# Altium project 2026MM.PrjPcb (part 2 of 10)
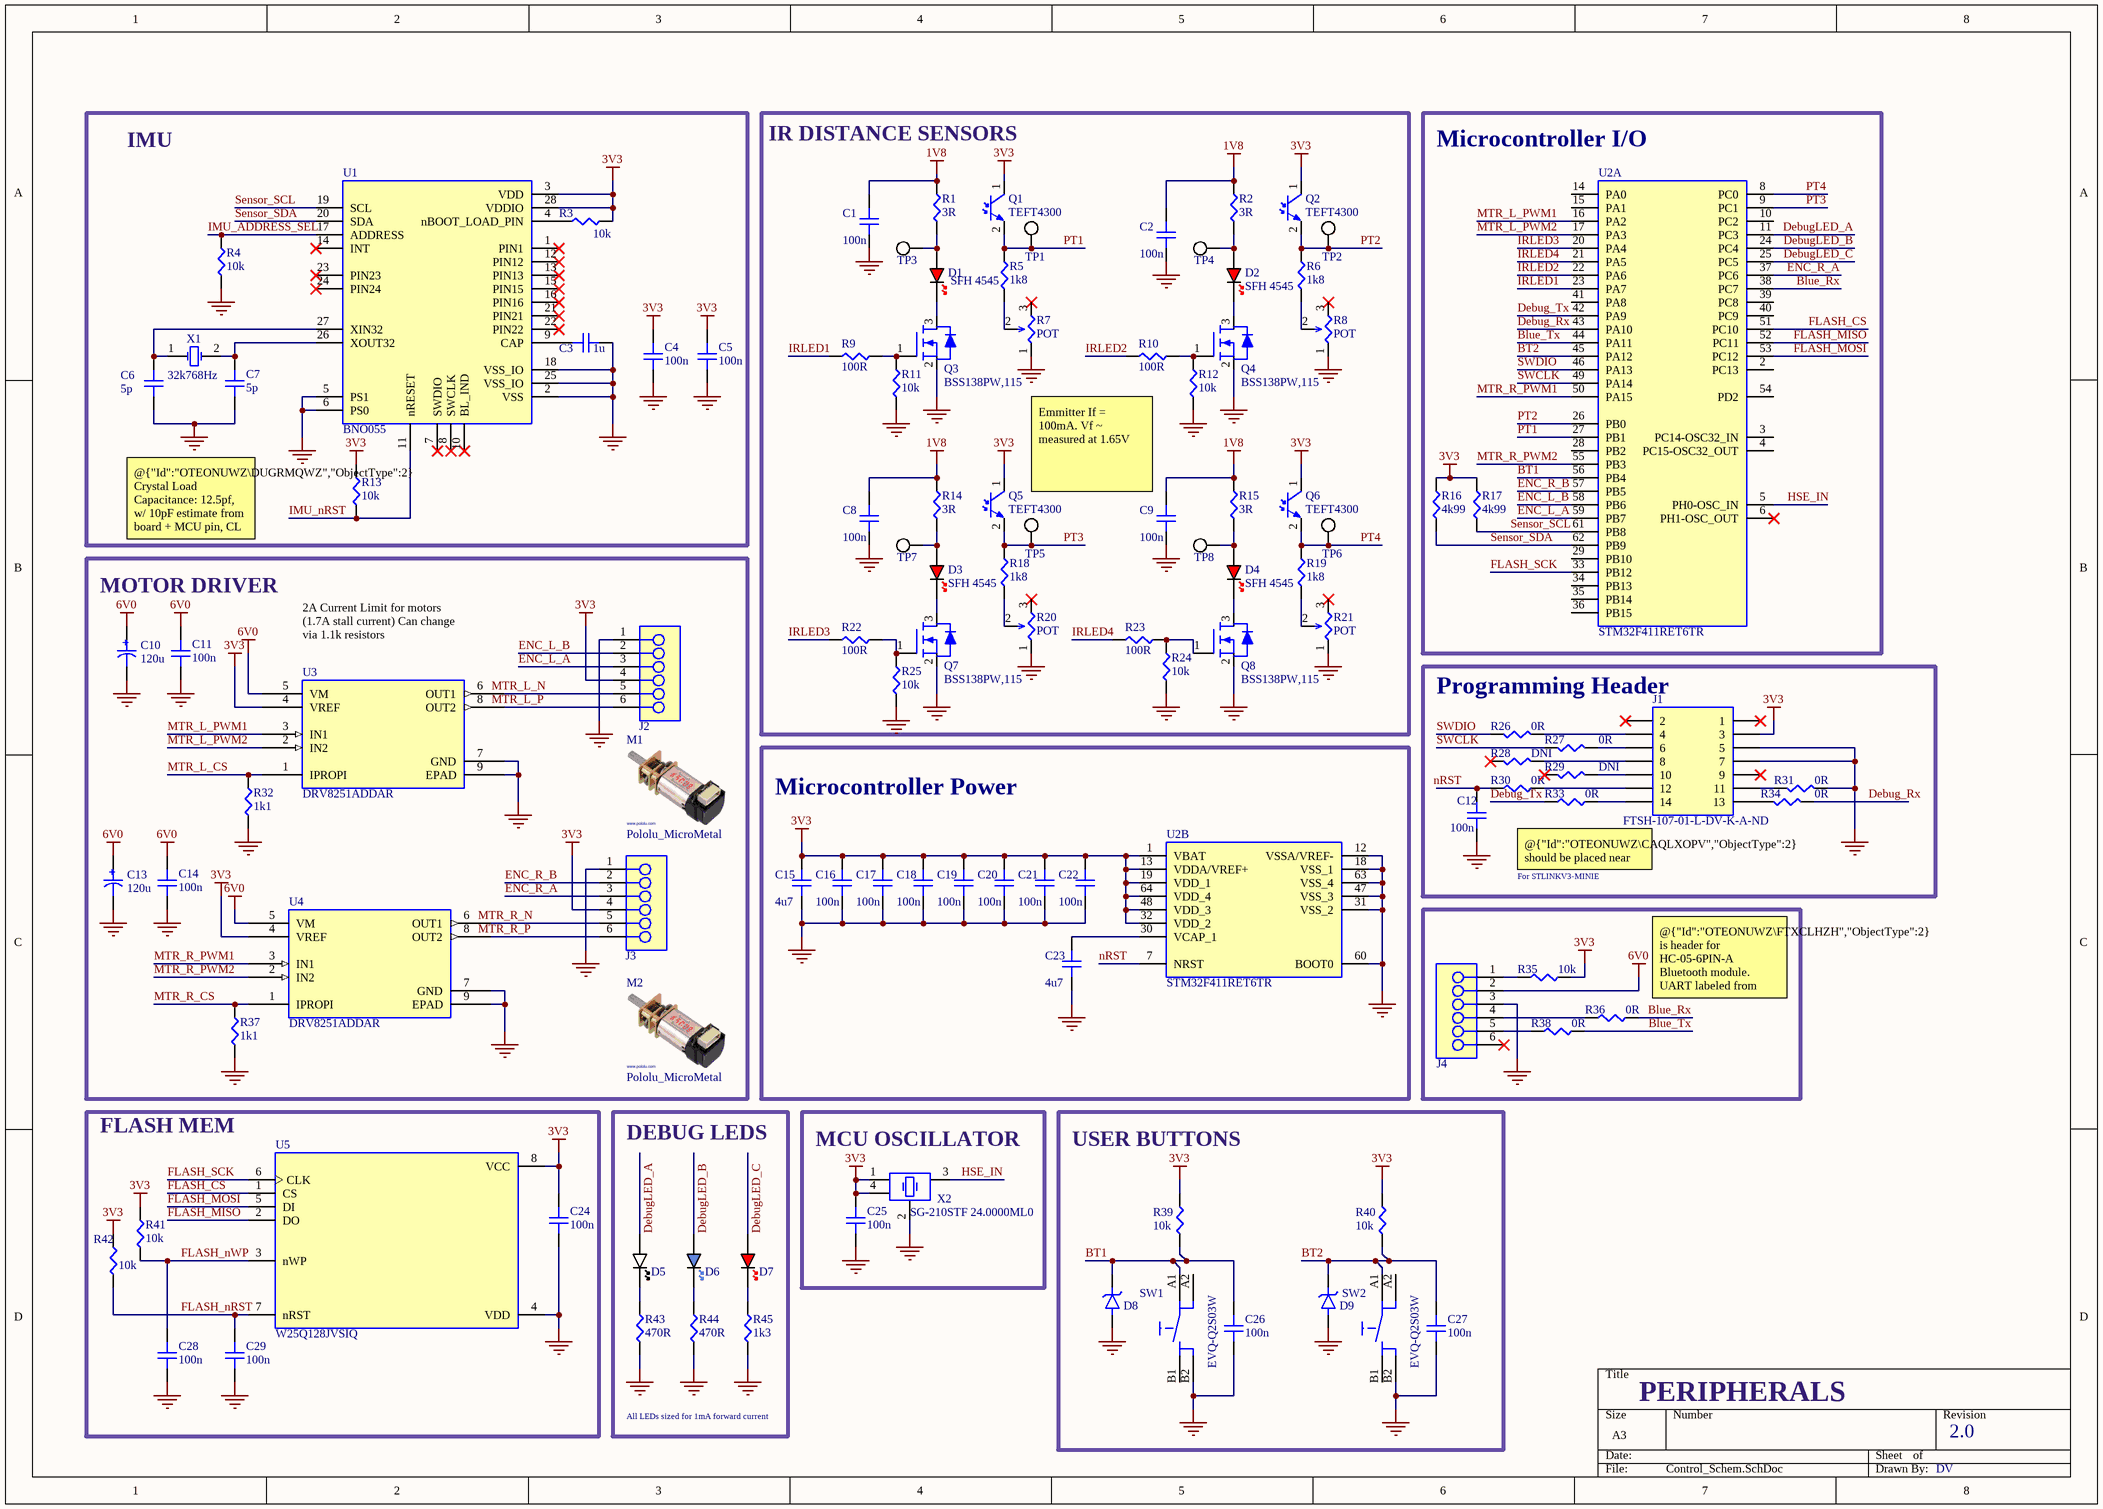
[diagram p2: Control_Schem.SchDoc]

## Sheet Control_Schem.SchDoc (continued)

### Library data of the parts (continued)
C24 = CAP: 50V 100nF X7R ±10% 0603 Multilayer Ceramic Capacitors MLCC - SMD/SMT ROHS; Manufacturer: Yageo Group; Manufacturer Part Number: C0603C104K5RACTU; Dissipation Factor: 2.5%; Temperature Coefficient: 30ppm/°C; Value: 100n; Supplier: Avnet; Supplier Part Number: C0603C104K5RACTU; RoHS: Compliant; Category: Ceramic Capacitors; Stock: 848000; Pricing: 4000=0.01077, 8000=0.01035, 16000=0.00996, 32000=0.00963, 64000=0.00933 (USD); Case/Package: 0603; Case Code (Imperial): 0603; China RoHS: Compliant; Contact Plating: Tin; Country of Origin: Mexico; Depth: 800µm; Dielectric: X7R; Dielectric Material: Ceramic; Export Control Classification Number (ECCN) Code: EAR99; Height: 800µm; Harmonized Tariff Schedule (HTS) Code: 8532.24.00.20; Introduction Date: 2011-07-27; Lead Free: Lead Free; Lead Pitch: 700µm; Length: 1.6mm; Lifecycle Status: Production; Material: Ceramic; Max Operating Temperature: 125°C; Min Operating Temperature: -55°C; Mounting Technology: Surface Mount; Pins: 2; Number of Terminals: 2; Packaging: Tape & Reel; Radiation Hardening: No; REACH SVHC: Yes; Schedule B: 8532240020, 8532240020|8532240020, 8532240020|8532240020|8532240020, 8532240020|8532240020|8532240020|8532240020; Termination: SMD/SMT; Thickness: 863.6µm; Tolerance: 10%; Voltage: 50V; Voltage Rating: 50V; Voltage Rating (DC): 50V; Width: 800µm; ComponentLink1URL: https://datasheet.octopart.com:443/C0603C104K5RACTU-KEMET-datasheet-178445679.pdf?src-supplier=IHS; ComponentLink1Description: https://datasheet.octopart.com:443/C0603C104K5RACTU-KEMET-datasheet-178445679.pdf?src-supplier=IHS; ComponentLink2URL: https://datasheet.octopart.com:443/C0603C104K5RAC7867-KEMET-datasheet-184792804.pdf?src-supplier=IHS; ComponentLink2Description: https://datasheet.octopart.com:443/C0603C104K5RAC7867-KEMET-datasheet-184792804.pdf?src-supplier=IHS; ComponentLink3URL: https://datasheet.octopart.com:443/C0603C104K5RACTU-KEMET-datasheet-137357759.pdf?src-supplier=Farnell; ComponentLink3Description: https://datasheet.octopart.com:443/C0603C104K5RACTU-KEMET-datasheet-137357759.pdf?src-supplier=Farnell; ComponentLink4URL: https://datasheet.octopart.com:443/C0603C104K5RACTU-KEMET-datasheet-149521864.pdf?src-supplier=Farnell; ComponentLink4Description: https://datasheet.octopart.com:443/C0603C104K5RACTU-KEMET-datasheet-149521864.pdf?src-supplier=Farnell; ComponentLink5URL: https://datasheet.octopart.com:443/C0603C104K5RACTU-KEMET-datasheet-101575654.pdf?src-supplier=Farnell; ComponentLink5Description: https://datasheet.octopart.com:443/C0603C104K5RACTU-KEMET-datasheet-101575654.pdf?src-supplier=Farnell; ComponentLink6URL: https://datasheet.octopart.com:443/C0603C104K5RACTU-KEMET-datasheet-176142159.pdf?src-supplier=Farnell; ComponentLink6Description: https://datasheet.octopart.com:443/C0603C104K5RACTU-KEMET-datasheet-176142159.pdf?src-supplier=Farnell; ComponentLink7URL: https://datasheet.octopart.com:443/C0603C104K5RAC-TU-Kemet-datasheet-7833651.pdf?src-supplier=Farnell; ComponentLink7Description: https://datasheet.octopart.com:443/C0603C104K5RAC-TU-Kemet-datasheet-7833651.pdf?src-supplier=Farnell; ComponentLink8URL: https://datasheet.octopart.com:443/C0603C104K5RAC-TU-Kemet-datasheet-7601896.pdf?src-supplier=Farnell; ComponentLink8Description: https://datasheet.octopart.com:443/C0603C104K5RAC-TU-Kemet-datasheet-7601896.pdf?src-supplier=Farnell; ComponentLink9URL: https://datasheet.octopart.com:443/C0603C104K5RAC-TU-Kemet-datasheet-5316294.pdf?src-supplier=Farnell; ComponentLink9Description: https://datasheet.octopart.com:443/C0603C104K5RAC-TU-Kemet-datasheet-5316294.pdf?src-supplier=Farnell; ComponentLink10URL: https://datasheet.octopart.com:443/C0603C104K5RAC-TU-Kemet-datasheet-5314837.pdf?src-supplier=Farnell; ComponentLink10Description: https://datasheet.octopart.com:443/C0603C104K5RAC-TU-Kemet-datasheet-5314837.pdf?src-supplier=Farnell; ComponentLink11URL: https://datasheet.octopart.com:443/C0603C104K5RAC-TU-Kemet-datasheet-8092359.pdf?src-supplier=Farnell; ComponentLink11Description: https://datasheet.octopart.com:443/C0603C104K5RAC-TU-Kemet-datasheet-8092359.pdf?src-supplier=Farnell; ComponentLink12URL: https://datasheet.octopart.com:443/C0603C104K5RAC-TU-Kemet-datasheet-5314449.pdf?src-supplier=Farnell; ComponentLink12Description: https://datasheet.octopart.com:443/C0603C104K5RAC-TU-Kemet-datasheet-5314449.pdf?src-supplier=Farnell; ComponentLink13URL: https://datasheet.octopart.com:443/C0603C104K5RAC-TU-Kemet-datasheet-5314969.pdf?src-supplier=Farnell; ComponentLink13Description: https://datasheet.octopart.com:443/C0603C104K5RAC-TU-Kemet-datasheet-5314969.pdf?src-supplier=Farnell; ComponentLink14URL: https://datasheet.octopart.com:443/C0603C104K5RAC-TU-Kemet-datasheet-5314627.pdf?src-supplier=Farnell; ComponentLink14Description: https://datasheet.octopart.com:443/C0603C104K5RAC-TU-Kemet-datasheet-5314627.pdf?src-supplier=Farnell; ComponentLink15URL: https://datasheet.octopart.com:443/C0603C104K5RAC-TU-Kemet-datasheet-5389132.pdf?src-supplier=Farnell; ComponentLink15Description: https://datasheet.octopart.com:443/C0603C104K5RAC-TU-Kemet-datasheet-5389132.pdf?src-supplier=Farnell; ComponentLink16URL: https://datasheet.octopart.com:443/C0603C104K5RAC-TU-Kemet-datasheet-5313836.pdf?src-supplier=Farnell; ComponentLink16Description: https://datasheet.octopart.com:443/C0603C104K5RAC-TU-Kemet-datasheet-5313836.pdf?src-supplier=Farnell; ComponentLink17URL: https://datasheet.octopart.com:443/C0603C104K5RAC-TU-Kemet-datasheet-8111010.pdf?src-supplier=Farnell; ComponentLink17Description: https://datasheet.octopart.com:443/C0603C104K5RAC-TU-Kemet-datasheet-8111010.pdf?src-supplier=Farnell; ComponentLink18URL: https://datasheet.octopart.com:443/C0603C104K5RAC-TU-Kemet-datasheet-7627733.pdf?src-supplier=Farnell; ComponentLink18Description: https://datasheet.octopart.com:443/C0603C104K5RAC-TU-Kemet-datasheet-7627733.pdf?src-supplier=Farnell; ComponentLink19URL: https://datasheet.octopart.com:443/C0603C104K5RAC-TU-Kemet-datasheet-5315946.pdf?src-supplier=Farnell; ComponentLink19Description: https://datasheet.octopart.com:443/C0603C104K5RAC-TU-Kemet-datasheet-5315946.pdf?src-supplier=Farnell; ComponentLink20URL: https://datasheet.octopart.com:443/C0603C104K5RACTU-KEMET-datasheet-137357764.pdf?src-supplier=Upverter; ComponentLink20Description: https://datasheet.octopart.com:443/C0603C104K5RACTU-KEMET-datasheet-137357764.pdf?src-supplier=Upverter; ComponentLink21URL: https://datasheet.octopart.com:443/C0603C104K5RAC-TU-Kemet-datasheet-5313890.pdf?src-supplier=Newark; ComponentLink21Description: https://datasheet.octopart.com:443/C0603C104K5RAC-TU-Kemet-datasheet-5313890.pdf?src-supplier=Newark; ComponentLink22URL: https://datasheet.octopart.com:443/C0603C104K5RACTU-Kemet-datasheet-12608295.pdf?src-supplier=Newark; ComponentLink22Description: https://datasheet.octopart.com:443/C0603C104K5RACTU-Kemet-datasheet-12608295.pdf?src-supplier=Newark; ComponentLink23URL: https://datasheet.octopart.com:443/C0603C104K5RACTU-Kemet-datasheet-11992184.pdf?src-supplier=Newark; ComponentLink23Description: https://datasheet.octopart.com:443/C0603C104K5RACTU-Kemet-datasheet-11992184.pdf?src-supplier=Newark; ComponentLink24URL: https://datasheet.octopart.com:443/C0603C104K5RACTU-Kemet-datasheet-10942409.pdf?src-supplier=Newark; ComponentLink24Description: https://datasheet.octopart.com:443/C0603C104K5RACTU-Kemet-datasheet-10942409.pdf?src-supplier=Newark; ComponentLink25URL: https://datasheet.octopart.com:443/C0603C104K5RACTU-Kemet-datasheet-10404442.pdf?src-supplier=Newark; ComponentLink25Description: https://datasheet.octopart.com:443/C0603C104K5RACTU-Kemet-datasheet-10404442.pdf?src-supplier=Newark; ComponentLink26URL: https://datasheet.octopart.com:443/C0603C104K5RAC-TU-Kemet-datasheet-5390537.pdf?src-supplier=Newark; ComponentLink26Description: https://datasheet.octopart.com:443/C0603C104K5RAC-TU-Kemet-datasheet-5390537.pdf?src-supplier=Newark; ComponentLink27URL: https://datasheet.octopart.com:443/C0603C104K5RAC-TU-Kemet-datasheet-7541751.pdf?src-supplier=Newark; ComponentLink27Description: https://datasheet.octopart.com:443/C0603C104K5RAC-TU-Kemet-datasheet-7541751.pdf?src-supplier=Newark; ComponentLink28URL: https://datasheet.octopart.com:443/C0603C104K5RACTU-KEMET-datasheet-171829795.pdf?src-supplier=Newark; ComponentLink28Description: https://datasheet.octopart.com:443/C0603C104K5RACTU-KEMET-datasheet-171829795.pdf?src-supplier=Newark; ComponentLink29URL: https://datasheet.octopart.com:443/C0603C104K5RACTU-Kemet-datasheet-8764837.pdf?src-supplier=Newark; ComponentLink29Description: https://datasheet.octopart.com:443/C0603C104K5RACTU-Kemet-datasheet-8764837.pdf?src-supplier=Newark; ComponentLink30URL: https://datasheet.octopart.com:443/C0603C104K5RACTU-Kemet-datasheet-8480123.pdf?src-supplier=Newark; ComponentLink30Description: https://datasheet.octopart.com:443/C0603C104K5RACTU-Kemet-datasheet-8480123.pdf?src-supplier=Newark; ComponentLink31URL: https://datasheet.octopart.com:443/C0603C104K5RACTU-Kemet-datasheet-5393970.pdf?src-supplier=Newark; ComponentLink31Description: https://datasheet.octopart.com:443/C0603C104K5RACTU-Kemet-datasheet-5393970.pdf?src-supplier=Newark; ComponentLink32URL: https://datasheet.octopart.com:443/C0603C104K5RACTU-Kemet-datasheet-8502025.pdf?src-supplier=Newark; ComponentLink32Description: https://datasheet.octopart.com:443/C0603C104K5RACTU-Kemet-datasheet-8502025.pdf?src-supplier=Newark; ComponentLink33URL: https://datasheet.octopart.com:443/C0603C104K5RACTU-Kemet-datasheet-161801.pdf?src-supplier=Newark; ComponentLink33Description: https://datasheet.octopart.com:443/C0603C104K5RACTU-Kemet-datasheet-161801.pdf?src-supplier=Newark; ComponentLink34URL: https://datasheet.octopart.com:443/C0603C104K5RACTU-Kemet-datasheet-32036385.pdf?src-supplier=Electro+Sonic; ComponentLink34Description: https://datasheet.octopart.com:443/C0603C104K5RACTU-Kemet-datasheet-32036385.pdf?src-supplier=Electro+Sonic; ComponentLink35URL: https://datasheet.octopart.com:443/C0603C104K5RACTU-KEMET-datasheet-157246124.pdf?src-supplier=Electro+Sonic; ComponentLink35Description: https://datasheet.octopart.com:443/C0603C104K5RACTU-KEMET-datasheet-157246124.pdf?src-supplier=Electro+Sonic; ComponentLink36URL: https://datasheet.octopart.com:443/C0603C104K5RACTU-KEMET-datasheet-164512540.pdf?src-supplier=TME; ComponentLink36Description: https://datasheet.octopart.com:443/C0603C104K5RACTU-KEMET-datasheet-164512540.pdf?src-supplier=TME; ComponentLink37URL: https://datasheet.octopart.com:443/C0603C104K5RACTU-Kemet-datasheet-67830781.pdf?src-supplier=TME; ComponentLink37Description: https://datasheet.octopart.com:443/C0603C104K5RACTU-Kemet-datasheet-67830781.pdf?src-supplier=TME; ComponentLink38URL: https://datasheet.octopart.com:443/C0603C104K5RACTU-KEMET-datasheet-68331906.pdf?src-supplier=TME; ComponentLink38Description: https://datasheet.octopart.com:443/C0603C104K5RACTU-KEMET-datasheet-68331906.pdf?src-supplier=TME; ComponentLink39URL: https://datasheet.octopart.com:443/C0603C104K5RAC7867-Kemet-datasheet-62098571.pdf?src-supplier=TME; ComponentLink39Description: https://datasheet.octopart.com:443/C0603C104K5RAC7867-Kemet-datasheet-62098571.pdf?src-supplier=TME; ComponentLink40URL: https://datasheet.octopart.com:443/C0603C104K5RAC7867-Kemet-datasheet-17577222.pdf?src-supplier=TME; ComponentLink40Description: https://datasheet.octopart.com:443/C0603C104K5RAC7867-Kemet-datasheet-17577222.pdf?src-supplier=TME; ComponentLink41URL: https://datasheet.octopart.com:443/C0603C104K5RACTU-KEMET-datasheet-110724412.pdf?src-supplier=RS+(Formerly+Allied+Electronics); ComponentLink41Description: https://datasheet.octopart.com:443/C0603C104K5RACTU-KEMET-datasheet-110724412.pdf?src-supplier=RS+(Formerly+Allied+Electronics); ComponentLink42URL: https://datasheet.octopart.com:443/C0603C104K5RACTU-Kemet-datasheet-464.pdf?src-supplier=RS+(Formerly+Allied+Electronics); ComponentLink42Description: https://datasheet.octopart.com:443/C0603C104K5RACTU-Kemet-datasheet-464.pdf?src-supplier=RS+(Formerly+Allied+Electronics); ComponentLink43URL: https://datasheet.octopart.com/C0603C104K5RACTU-KEMET-datasheet-84169754.pdf; ComponentLink43Description: https://datasheet.octopart.com/C0603C104K5RACTU-KEMET-datasheet-84169754.pdf; ComponentLink44URL: https://datasheet.octopart.com:443/C0603C104K5RACTU-Kemet-datasheet-24570007.pdf?src-supplier=element14+APAC; ComponentLink44Description: https://datasheet.octopart.com:443/C0603C104K5RACTU-Kemet-datasheet-24570007.pdf?src-supplier=element14+APAC; ComponentLink45URL: https://datasheet.octopart.com:443/C0603C104K5RACTU-Kemet-datasheet-22084244.pdf?src-supplier=element14+APAC; ComponentLink45Description: https://datasheet.octopart.com:443/C0603C104K5RACTU-Kemet-datasheet-22084244.pdf?src-supplier=element14+APAC; ComponentLink46URL: https://datasheet.octopart.com:443/C0603C104K5RACTU-Kemet-datasheet-21389238.pdf?src-supplier=element14+APAC; ComponentLink46Description: https://datasheet.octopart.com:443/C0603C104K5RACTU-Kemet-datasheet-21389238.pdf?src-supplier=element14+APAC; ComponentLink47URL: https://datasheet.octopart.com:443/C0603C104K5RACTU-Kemet-datasheet-11723057.pdf?src-supplier=Arrow+Electronics; ComponentLink47Description: https://datasheet.octopart.com:443/C0603C104K5RACTU-Kemet-datasheet-11723057.pdf?src-supplier=Arrow+Electronics; ComponentLink48URL: https://datasheet.octopart.com:443/C0603C104K5RAC7867-KEMET-datasheet-164857143.pdf?src-supplier=Burklin+Elektronik; ComponentLink48Description: https://datasheet.octopart.com:443/C0603C104K5RAC7867-KEMET-datasheet-164857143.pdf?src-supplier=Burklin+Elektronik; ComponentLink49URL: https://datasheet.octopart.com:443/C0603C104K5RAC-TU-Kemet-datasheet-8187850.pdf?src-supplier=Jameco; ComponentLink49Description: https://datasheet.octopart.com:443/C0603C104K5RAC-TU-Kemet-datasheet-8187850.pdf?src-supplier=Jameco; ComponentLink50URL: https://datasheet.octopart.com:443/C0603C104K5RACTU-Kemet-datasheet-122295.pdf?src-supplier=DigiKey; ComponentLink50Description: https://datasheet.octopart.com:443/C0603C104K5RACTU-Kemet-datasheet-122295.pdf?src-supplier=DigiKey; Supplier 1: Avnet; Supplier Part Number 1: C0603C104K5RACTU; ComponentLink51URL: http://sigma.octopart.com:80/conflict_mineral_statement/Yageo-company-3.pdf?src-supplier=Compliance+Statements; ComponentLink51Description: http://sigma.octopart.com:80/conflict_mineral_statement/Yageo-company-3.pdf?src-supplier=Compliance+Statements; ComponentLink52URL: http://sigma.octopart.com:80/rohs_statement/Yageo-company-2.pdf?src-supplier=Compliance+Statements; ComponentLink52Description: http://sigma.octopart.com:80/rohs_statement/Yageo-company-2.pdf?src-supplier=Compliance+Statements
D1-D4 = LED_Red: Radial T1 3/4 Infrared LED Infrared LED, 5mm, 1-Element, 950nm; Manufacturer: Osram; Fall Time: 12ns; Forward Current: 100mA; Forward Voltage: 1.7V; Lens Style: Circular, Dome; Max Power Dissipation: 180mW; Number of Circuits: 1; Output Power: 55mW; Power Dissipation: 180W; Reverse Voltage: 5V; Shape: Round; Touchscreen: Infrared (IR); Viewing Angle: 10°; Supplier 1: Rutronik; Supplier Part Number 1: IR5241; Manufacturer Part Number: SFH 4545; RoHS: Compliant; Category: LEDs; Stock: 100000; Pricing: 1000=0.2268, 2000=0.1849, 3000=0.1831, 4000=0.1814 (USD); Case/Package: Radial; China RoHS: Compliant; Contact Plating: Tin; Depth: 5.7mm; Height: 7.9mm; Harmonized Tariff Schedule (HTS) Code: 8541.40.20.00; Introduction Date: 2009-09-08; Length: 5.5mm; Lifecycle Status: Production; Max Operating Temperature: 100°C; Min Operating Temperature: -40°C; Mounting Technology: Through Hole; Number of Elements: 1; Number of LEDs: 1; Pins: 2; Orientation: Top View; Packaging: Tape & Reel; Peak Wavelength: 950nm; Power Rating: 180mW; Radiation Hardening: No; REACH SVHC: Yes; Reverse Voltage (DC): 5V; Rise Time: 12ns; Schedule B: 8541402000, 8541402000|8541402000|8541402000|8541402000|8541402000; Test Current: 100mA; Width: 5.5mm; ComponentLink1URL: https://datasheet.octopart.com:443/Q65110A8095-Osram-Opto-datasheet-182349644.pdf?src-supplier=IHS; ComponentLink1Description: https://datasheet.octopart.com:443/Q65110A8095-Osram-Opto-datasheet-182349644.pdf?src-supplier=IHS; ComponentLink2URL: https://datasheet.octopart.com:443/SFH-4545-Osram-Opto-datasheet-142374590.pdf?src-supplier=Osram+Opto+SCT; ComponentLink2Description: https://datasheet.octopart.com:443/SFH-4545-Osram-Opto-datasheet-142374590.pdf?src-supplier=Osram+Opto+SCT; ComponentLink3URL: https://datasheet.octopart.com:443/SFH-4545-Osram-datasheet-68365660.pdf?src-supplier=TME; ComponentLink3Description: https://datasheet.octopart.com:443/SFH-4545-Osram-datasheet-68365660.pdf?src-supplier=TME; ComponentLink4URL: https://datasheet.octopart.com:443/Q65110A8095-Osram-datasheet-13703669.pdf?src-supplier=_legacy+Avnet; ComponentLink4Description: https://datasheet.octopart.com:443/Q65110A8095-Osram-datasheet-13703669.pdf?src-supplier=_legacy+Avnet; ComponentLink5URL: https://datasheet.octopart.com:443/SFH-4545-Osram-Sylvania-datasheet-17020525.pdf?src-supplier=Factory+Futures; ComponentLink5Description: https://datasheet.octopart.com:443/SFH-4545-Osram-Sylvania-datasheet-17020525.pdf?src-supplier=Factory+Futures
D5 = LED_White: White 1.6 x 0.8 x 0.55 mm 130° Tinted Yellow 180 mcd 3 V LED SMT; Manufacturer: Diodes Inc.; Manufacturer Part Number: LTW-C191DS5; Forward Current: 20mA; Forward Voltage: 3.15V; Lens Style: Colored, Rectangular, Tinted; Luminous Intensity: 125.5mcd; Number of Circuits: 1; Power Dissipation: 72mW; Reverse Voltage: 5V; Shape: Rectangular; Test Current: 5mA; Supplier 1: Avnet; Supplier Part Number 1: LTW-C191DS5; RoHS: Compliant; Category: LEDs; Stock: 35000; Pricing: 5000=0.10228, 10000=0.09997, 20000=0.09766, 40000=0.09536, 80000=0.09305 (USD); Case/Package: 0603; China RoHS: Compliant; Color: White; Depth: 800µm; Height: 550µm; Harmonized Tariff Schedule (HTS) Code: 8541.40.20.00; Illumination Color: White; Introduction Date: 2006-05-17; Lead Free: Lead Free; Length: 1.6mm; Lens Color: Yellow; Lifecycle Status: Production; Max Operating Temperature: 85°C; Manufacturer Package Identifier: LTW-C191DS5; Min Operating Temperature: -30°C; Mounting Technology: Surface Mount; Number of Elements: 1; Number of LEDs: 1; Pins: 2; Number of Terminals: 2; Radiation Hardening: No; REACH SVHC: Yes; Terminal Pitch: 1.5mm; Viewing Angle: 130°; Width: 800µm; ComponentLink1URL: https://sigma.octopart.com:443/141906765/technical_drawing/Lite-On-LTW-C191DS5.pdf?src-supplier=IHS; ComponentLink1Description: https://sigma.octopart.com:443/141906765/technical_drawing/Lite-On-LTW-C191DS5.pdf?src-supplier=IHS; ComponentLink2URL: https://datasheet.octopart.com:443/LTW-C191DS5-Lite-On-datasheet-138896769.pdf?src-supplier=Upverter; ComponentLink2Description: https://datasheet.octopart.com:443/LTW-C191DS5-Lite-On-datasheet-138896769.pdf?src-supplier=Upverter; ComponentLink3URL: https://datasheet.octopart.com:443/LTW-C191DS5-Lite-On-datasheet-26684820.pdf?src-supplier=TME; ComponentLink3Description: https://datasheet.octopart.com:443/LTW-C191DS5-Lite-On-datasheet-26684820.pdf?src-supplier=TME; ComponentLink4URL: https://datasheet.octopart.com:443/LTW-C191DS5-Lite-On-datasheet-165573808.pdf?src-supplier=TME; ComponentLink4Description: https://datasheet.octopart.com:443/LTW-C191DS5-Lite-On-datasheet-165573808.pdf?src-supplier=TME; ComponentLink5URL: https://datasheet.octopart.com:443/LTW-C191DS5-Lite-On-datasheet-86397359.pdf?src-supplier=ODG+(Origin+Data+Global); ComponentLink5Description: https://datasheet.octopart.com:443/LTW-C191DS5-Lite-On-datasheet-86397359.pdf?src-supplier=ODG+(Origin+Data+Global); ComponentLink6URL: https://datasheet.octopart.com:443/LTW-C191DS5-Lite-On-datasheet-13698150.pdf?src-supplier=_legacy+Avnet; ComponentLink6Description: https://datasheet.octopart.com:443/LTW-C191DS5-Lite-On-datasheet-13698150.pdf?src-supplier=_legacy+Avnet; ComponentLink7URL: https://datasheet.octopart.com:443/LTW-C191DS5-Lite-On-datasheet-12531532.pdf?src-supplier=Future+Electronics; ComponentLink7Description: https://datasheet.octopart.com:443/LTW-C191DS5-Lite-On-datasheet-12531532.pdf?src-supplier=Future+Electronics
D6 = LED_Blue: LED blue 0603 wavelength 465~475nm light intensity 15mcd Front Mounting; Manufacturer: Diodes Inc.; Manufacturer Part Number: LTST-C193TBKT-5A; Dominant Wavelength: 475nm; Forward Current: 20mA; Forward Voltage: 2.8V; Lens Color: Clear, Colorless; Lens Style: Clear, Colorless, Diffused, Rectangular; Lens Transparency: Clear; Number of Circuits: 1; Peak Wavelength: 468nm; Power Dissipation: 76mW; Reverse Voltage: 5V; Shape: Rectangular; Test Current: 5mA; Viewing Angle: 130°; Wavelength: 470nm; Supplier 1: Avnet; Supplier Part Number 1: LTST-C193TBKT-5A; RoHS: Compliant; Category: LEDs; Stock: 200000; Pricing: 5000=0.04509, 10000=0.04407, 20000=0.04305, 40000=0.04204, 80000=0.04102 (USD); Case/Package: 0603; Case Code (Imperial): 0603; Case Code (Metric): 1608; China RoHS: Compliant; Color: Blue; Contact Plating: Tin; Depth: 800µm; Height: 350µm; Illumination Color: Blue; Lead Free: Lead Free; Length: 1.6mm; Lifecycle Status: Production; Luminous Intensity: 15mcd; Max Operating Temperature: 80°C; Min Operating Temperature: -20°C; Mounting Technology: Surface Mount; Number of Elements: 1; Number of LEDs: 1; Pins: 2; Number of Terminals: 2; Radiation Hardening: No; REACH SVHC: Yes; Schedule B: 8541402000, 8541402000|8541402000|8541402000|8541402000|8541402000; Terminal Pitch: 1.5mm; Width: 800µm; ComponentLink1URL: https://datasheet.octopart.com:443/LTST-C193TBKT-5A-Lite-On-datasheet-26684754.pdf?src-supplier=IHS; ComponentLink1Description: https://datasheet.octopart.com:443/LTST-C193TBKT-5A-Lite-On-datasheet-26684754.pdf?src-supplier=IHS; ComponentLink2URL: https://datasheet.octopart.com:443/LTST-C193TBKT-5A-Lite-On-datasheet-12541985.pdf?src-supplier=Upverter; ComponentLink2Description: https://datasheet.octopart.com:443/LTST-C193TBKT-5A-Lite-On-datasheet-12541985.pdf?src-supplier=Upverter; ComponentLink3URL: https://datasheet.octopart.com:443/LTST-C193TBKT-5A-Lite-On-datasheet-165573808.pdf?src-supplier=TME; ComponentLink3Description: https://datasheet.octopart.com:443/LTST-C193TBKT-5A-Lite-On-datasheet-165573808.pdf?src-supplier=TME; ComponentLink4URL: https://datasheet.octopart.com:443/LTST-C193TBKT-5A-Lite-On-datasheet-14174967.pdf?src-supplier=iiiC; ComponentLink4Description: https://datasheet.octopart.com:443/LTST-C193TBKT-5A-Lite-On-datasheet-14174967.pdf?src-supplier=iiiC
D7 = LED_Red: Single-color LEDs; LITEON; LTST-C193KRKT-5A; Red; 130 °; 2.3 V; 0603; Manufacturer: Diodes Inc.; Dominant Wavelength: 631nm; Forward Current: 20mA; Forward Voltage: 2.3V; Lens Color: Clear, Colorless; Lens Style: Clear, Colorless, Diffused, Rectangular; Lens Transparency: Clear; Luminous Intensity: 26.05mcd; Number of Circuits: 1; Peak Wavelength: 639nm; Power Dissipation: 50mW; Reverse Voltage: 5V; Shape: Rectangular; Test Current: 5mA; Viewing Angle: 130°; Supplier 1: Avnet; Supplier Part Number 1: LTST-C193KRKT-5A; Manufacturer Part Number: LTST-C193KRKT-5A; RoHS: Compliant; Category: LEDs; Stock: 250000; Pricing: 5000=0.03977, 10000=0.03887, 20000=0.03797, 40000=0.03708, 80000=0.03618 (USD); Case/Package: 0603; Case Code (Imperial): 0603; Case Code (Metric): 1608; China RoHS: Compliant; Color: Red; Country of Origin: Mainland China, Thailand; Depth: 800µm; Export Control Classification Number (ECCN) Code: EAR99; Height: 350µm; Harmonized Tariff Schedule (HTS) Code: 8541.40.20.00; Illumination Color: Red; Introduction Date: 2008-09-01; Lead Free: Lead Free; Length: 1.6mm; Lifecycle Status: Production; Max Operating Temperature: 85°C; Min Operating Temperature: -30°C; Mounting Technology: Surface Mount; Number of Elements: 1; Number of LEDs: 1; Pins: 2; Number of Terminals: 2; Radiation Hardening: No; REACH SVHC: Yes; Schedule B: 8541402000, 8541402000|8541402000|8541402000|8541402000|8541402000; Terminal Pitch: 1.5mm; Wavelength: 631nm; Width: 800µm; ComponentLink1URL: https://datasheet.octopart.com:443/LTST-C193KRKT-5A-Lite-On-datasheet-141422095.pdf?src-supplier=ODG+(Origin+Data+Global); ComponentLink1Description: https://datasheet.octopart.com:443/LTST-C193KRKT-5A-Lite-On-datasheet-141422095.pdf?src-supplier=ODG+(Origin+Data+Global); ComponentLink2URL: https://datasheet.octopart.com:443/LTST-C193KRKT-5A-Lite-On-datasheet-86397331.pdf?src-supplier=Upverter; ComponentLink2Description: https://datasheet.octopart.com:443/LTST-C193KRKT-5A-Lite-On-datasheet-86397331.pdf?src-supplier=Upverter; ComponentLink3URL: https://datasheet.octopart.com:443/LTST-C193KRKT-5A-Lite-On-datasheet-180605208.pdf?src-supplier=IHS; ComponentLink3Description: https://datasheet.octopart.com:443/LTST-C193KRKT-5A-Lite-On-datasheet-180605208.pdf?src-supplier=IHS; ComponentLink4URL: https://datasheet.octopart.com:443/LTST-C193KRKT-5A-Lite-On-datasheet-26684753.pdf?src-supplier=TME; ComponentLink4Description: https://datasheet.octopart.com:443/LTST-C193KRKT-5A-Lite-On-datasheet-26684753.pdf?src-supplier=TME; ComponentLink5URL: https://datasheet.octopart.com:443/LTST-C193KRKT-5A-Lite-On-datasheet-165573808.pdf?src-supplier=TME; ComponentLink5Description: https://datasheet.octopart.com:443/LTST-C193KRKT-5A-Lite-On-datasheet-165573808.pdf?src-supplier=TME; ComponentLink6URL: https://datasheet.octopart.com:443/LTST-C193KRKT-5A-Lite-On-datasheet-13688521.pdf?src-supplier=_legacy+Avnet; ComponentLink6Description: https://datasheet.octopart.com:443/LTST-C193KRKT-5A-Lite-On-datasheet-13688521.pdf?src-supplier=_legacy+Avnet; ComponentLink7URL: https://datasheet.octopart.com:443/LTST-C193KRKT-5A-Lite-On-datasheet-137080926.pdf?src-supplier=X-ON; ComponentLink7Description: https://datasheet.octopart.com:443/LTST-C193KRKT-5A-Lite-On-datasheet-137080926.pdf?src-supplier=X-ON; ComponentLink8URL: https://datasheet.octopart.com:443/LTST-C193KRKT-5A-Lite-On-datasheet-11563339.pdf?src-supplier=Arrow+Electronics; ComponentLink8Description: https://datasheet.octopart.com:443/LTST-C193KRKT-5A-Lite-On-datasheet-11563339.pdf?src-supplier=Arrow+Electronics; ComponentLink9URL: https://datasheet.octopart.com:443/LTST-C193KRKT-5A-Lite-On-datasheet-14174970.pdf?src-supplier=iiiC; ComponentLink9Description: https://datasheet.octopart.com:443/LTST-C193KRKT-5A-Lite-On-datasheet-14174970.pdf?src-supplier=iiiC; ComponentLink10URL: https://datasheet.octopart.com:443/LTST-C193KRKT-5A-Lite-On-datasheet-25360257.pdf?src-supplier=Future+Electronics; ComponentLink10Description: https://datasheet.octopart.com:443/LTST-C193KRKT-5A-Lite-On-datasheet-25360257.pdf?src-supplier=Future+Electronics
D8 D9 = Zenner: ESD9X5.0ST5G Series 6.2 V 65 pF TVS Diode for ESD Protection - SOD-923; Manufacturer: onsemi; Manufacturer Lifecycle Status: ACTIVE; Breakdown Voltage: 6.2V; Clamping Voltage: 12.3V; Direction: Unidirectional; Element Configuration: Single; ESD Protection: Yes; Forward Voltage: 1.1V; Leakage Current: 1µA; Max Junction Temperature (Tj): 150°C; Max Power Dissipation: 150mW; Max Surge Current: 8.7A; Number of Channels: 1; Operating Supply Voltage: 5V; Peak Pulse Power: 107W; Power Line Protection: No; Test Current: 1mA; Supplier 1: Future Electronics; Supplier Part Number 1: ESD9X5.0ST5G; Manufacturer Part Number: ESD9X5.0ST5G; RoHS: Compliant; Category: TVS Diodes; Stock: 200000; Pricing: 8000=0.0268, 24000=0.0262, 32000=0.0261, 80000=0.0255, 120000=0.025 (USD); Value: 65pF; Case/Package: SOD-923-2; China RoHS: Compliant; Composition: Zener; Contact Plating: Tin; Depth: 600µm; Halogen Free: Halogen Free; Height: 400µm; Lead Free: Lead Free; Length: 800µm; Lifecycle Status: Production; Max Breakdown Voltage: 6.2V; Max Operating Temperature: 150°C; Max Reverse Leakage Current: 1µA; Min Breakdown Voltage: 6.2V; Min Operating Temperature: -55°C; Number of Circuits: 1; Number of Elements: 1; Number of Lines: 1; Pins: 2; Number of Terminals: 2; Number of Unidirectional Channels: 1; Packaging: Tape and Reel; Peak Pulse Current: 8.7A; Peak Reverse Current: 1µA; Polarity: Unidirectional; Radiation Hardening: No; REACH SVHC: Yes; Reverse Breakdown Voltage: 6.2V; Reverse Standoff Voltage: 5V; Schedule B: 8536300000, 8536300000|8536300000|8536300000|8536300000|8536300000|8536300000|8536300000|8536300000|8536300000|8536300000|8536300000|8536300000|8536300000|8536300000|8536300000|8536300000|8536300000|8536300000|8536300000|8536300000|8536300000|8536300000|8536300000|85; Termination: SMD/SMT; Width: 650µm; Working Voltage: 5V; ComponentLink1URL: https://datasheet.octopart.com:443/ESD9X5.0ST5G-ON-Semiconductor-datasheet-8330357.pdf?src-supplier=Upverter; ComponentLink1Description: https://datasheet.octopart.com:443/ESD9X5.0ST5G-ON-Semiconductor-datasheet-8330357.pdf?src-supplier=Upverter; ComponentLink2URL: https://datasheet.octopart.com:443/ESD9X5.0ST5G-onsemi-datasheet-168568609.pdf?src-supplier=Upverter; ComponentLink2Description: https://datasheet.octopart.com:443/ESD9X5.0ST5G-onsemi-datasheet-168568609.pdf?src-supplier=Upverter; ComponentLink3URL: https://datasheet.octopart.com:443/ESD9X5.0ST5G-ON-Semiconductor-datasheet-139009868.pdf?src-supplier=Electro+Sonic; ComponentLink3Description: https://datasheet.octopart.com:443/ESD9X5.0ST5G-ON-Semiconductor-datasheet-139009868.pdf?src-supplier=Electro+Sonic; ComponentLink4URL: https://datasheet.octopart.com:443/ESD9X5.0ST5G-onsemi-datasheet-180958921.pdf?src-supplier=IHS; ComponentLink4Description: https://datasheet.octopart.com:443/ESD9X5.0ST5G-onsemi-datasheet-180958921.pdf?src-supplier=IHS; ComponentLink5URL: https://datasheet.octopart.com:443/ESD9X5.0ST5G-ON-Semiconductor-datasheet-12513463.pdf?src-supplier=Newark; ComponentLink5Description: https://datasheet.octopart.com:443/ESD9X5.0ST5G-ON-Semiconductor-datasheet-12513463.pdf?src-supplier=Newark; ComponentLink6URL: https://datasheet.octopart.com:443/ESD9X5.0ST5G-onsemi-datasheet-189128587.pdf?src-supplier=Master+Electronics; ComponentLink6Description: https://datasheet.octopart.com:443/ESD9X5.0ST5G-onsemi-datasheet-189128587.pdf?src-supplier=Master+Electronics; ComponentLink7URL: https://datasheet.octopart.com:443/ESD9X5.0ST5G-onsemi-datasheet-164667579.pdf?src-supplier=Newchip+Electronics+Limited; ComponentLink7Description: https://datasheet.octopart.com:443/ESD9X5.0ST5G-onsemi-datasheet-164667579.pdf?src-supplier=Newchip+Electronics+Limited; ComponentLink8URL: https://datasheet.octopart.com:443/ESD9X5.0ST5G-ON-Semiconductor-datasheet-14047635.pdf?src-supplier=iiiC; ComponentLink8Description: https://datasheet.octopart.com:443/ESD9X5.0ST5G-ON-Semiconductor-datasheet-14047635.pdf?src-supplier=iiiC; ComponentLink9URL: http://sigma.octopart.com:80/15540786/rohs_certificate/ON-Semiconductor-ESD9X5.0ST5G.pdf?src-supplier=Compliance+Statements; ComponentLink9Description: http://sigma.octopart.com:80/15540786/rohs_certificate/ON-Semiconductor-ESD9X5.0ST5G.pdf?src-supplier=Compliance+Statements; ComponentLink10URL: http://sigma.octopart.com:80/15676178/materials_sheet/ON-Semiconductor-ESD9X5.0ST5G.csv?src-supplier=Compliance+Statements; ComponentLink10Description: http://sigma.octopart.com:80/15676178/materials_sheet/ON-Semiconductor-ESD9X5.0ST5G.csv?src-supplier=Compliance+Statements; ComponentLink11URL: http://sigma.octopart.com:80/150607609/rohs_statement/ON-Semiconductor-ESD9X5.0ST5G.pdf?src-supplier=Compliance+Statements; ComponentLink11Description: http://sigma.octopart.com:80/150607609/rohs_statement/ON-Semiconductor-ESD9X5.0ST5G.pdf?src-supplier=Compliance+Statements; ComponentLink12URL: http://sigma.octopart.com:80/reach_statement/ON-Semiconductor-company-79.pdf?src-supplier=Compliance+Statements; ComponentLink12Description: http://sigma.octopart.com:80/reach_statement/ON-Semiconductor-company-79.pdf?src-supplier=Compliance+Statements; ComponentLink13URL: https://octopart.com:443/opatz8j6/c1?t=U4xq248CjZk49aqVlr5k0EZ1S20O7hXZC5x3rHWSH-sYxZ_igJwI8JXMjxjum5nk7b2LPFvSUdjhtWeLCCyF45HKJ3gQrOw2ICCLdwIt4F_CeAv9k9h4bPg01xsOqGsl4_WPHk2-sHZisKbPVHvESszEH42MI_EGcnWZn37s8EDrb9R9sRHl5QrF73OS571ory3wTq49jEdwCvmsvOyGlnMZqdznSgUnAulqt8UeVTtCWi1h0LjaV3_jenB72zXObhJcrUkKGX87J72uvMIaqlf2gdrzqerpU4qgDLbtRMl999sH-387FE5OvjKwPt4qFBwoXQia9kWdxdoPHguyJMxxDQ6CZJ78I1Jz7wf_&src-supplier=Compliance+Statements; ComponentLink13Description: https://octopart.com:443/opatz8j6/c1?t=U4xq248CjZk49aqVlr5k0EZ1S20O7hXZC5x3rHWSH-sYxZ_igJwI8JXMjxjum5nk7b2LPFvSUdjhtWeLCCyF45HKJ3gQrOw2ICCLdwIt4F_CeAv9k9h4bPg01xsOqGsl4_WPHk2-sHZisKbPVHvESszEH42MI_EGcnWZn37s8EDrb9R9sRHl5QrF73OS571ory3wTq49jEdwCvmsvOyGlnMZqdznSgUnAulqt8UeVTtCWi1h0LjaV3_jenB72zXObhJcrUkKGX87J72uvMIaqlf2gdrzqerpU4qgDLbtRMl999sH-387FE5OvjKwPt4qFBwoXQia9kWdxdoPHguyJMxxDQ6CZJ78I1Jz7wf_&src-supplier=Compliance+Statements; ComponentLink14URL: https://octopart.com:443/opatz8j6/c1?t=3pWjA3sury-vXDZ6jn5EtAlCMoxYtX1AYxU0u-L05MRKzzY3i90hWYZqBJ7nD0FpcxQU6NVvWSfrj8spDvkDVcv6hBGs2FKejoF387FKwRHUXxrKuAp20zxQf1xviP5DOSGH0oDp6nciOnSgABqDgBRfE1IdXVb1HgMibrXHg5ILIw0i4bTNvinhI9nbqtNHG7c2z1LCxAmzkrm1UggRYQnaU9WfKM8lDyf7V15dE3D-xK99Oqq1XK1trMaZ5tCK2HDTe7-XsgP0FTthRAXuAn3xjXwE5sHZ4Tfbg-hc08R_QhUItco4PPzxqp_Ni38_sf5Aw8nlbFeh5fp6Pc1W3BfPLWy2YwzTcFmoPFUupg&src-supplier=Compliance+Statements; ComponentLink14Description: https://octopart.com:443/opatz8j6/c1?t=3pWjA3sury-vXDZ6jn5EtAlCMoxYtX1AYxU0u-L05MRKzzY3i90hWYZqBJ7nD0FpcxQU6NVvWSfrj8spDvkDVcv6hBGs2FKejoF387FKwRHUXxrKuAp20zxQf1xviP5DOSGH0oDp6nciOnSgABqDgBRfE1IdXVb1HgMibrXHg5ILIw0i4bTNvinhI9nbqtNHG7c2z1LCxAmzkrm1UggRYQnaU9WfKM8lDyf7V15dE3D-xK99Oqq1XK1trMaZ5tCK2HDTe7-XsgP0FTthRAXuAn3xjXwE5sHZ4Tfbg-hc08R_QhUItco4PPzxqp_Ni38_sf5Aw8nlbFeh5fp6Pc1W3BfPLWy2YwzTcFmoPFUupg&src-supplier=Compliance+Statements
J2 J3 = 6POS: Connector Header, SR Series, 6 Position, 1.00mm, 50V, Surface Mount, Tin, Natural; Manufacturer: JST; Manufacturer Part Number: BM06B-SRSS-TB(LF)(SN); Connector Type: Male Pin; Contact Resistance: 40mΩ; Current Rating: 1A; Dielectric Material: Polyamide; Gender: Male; Insulation Resistance: 100MΩ; Number of Contacts: 6; Pitch: 1mm; Shape: Straight; Supplier 1: Future Electronics; Supplier Part Number 1: BM06B-SRSS-TB(LF)(SN); RoHS: Compliant; Category: Headers and Wire Housings; Stock: 27000; Pricing: 1500=0.35, 3000=0.345, 4500=0.34 (USD); China RoHS: Compliant; Color: Natural; Contact Material: Copper, Tin; Contact Plating: Tin; Country of Origin: Mainland China; Export Control Classification Number (ECCN) Code: EAR99; Flammability Rating: UL94 V-0; Height: 4.25mm; Housing Color: Natural; Housing Material: Nylon; Harmonized Tariff Schedule (HTS) Code: 8536.69.40.40; Introduction Date: 2009-02-11; Lead Free: Lead Free; Lead Pitch: 1mm; Length: 8mm; Lifecycle Status: Production; Material: Polyamide; Max Operating Temperature: 85°C; Min Operating Temperature: -25°C; Mounting Technology: Surface Mount; Pins: 6; Number of Poles: 6; Number of Positions: 6; Number of Rows: 1; Packaging: Cut Tape; REACH SVHC: Yes; Schedule B: 8536694040; Terminal Pitch: 1mm; Termination: Solder; Voltage Rating: 50V; Voltage Rating (AC): 50V; Width: 2.9mm; ComponentLink1URL: https://datasheet.octopart.com:443/BM06B-SRSS-TB%28LF%29%28SN%29-JST-datasheet-120967.pdf?src-supplier=Upverter; ComponentLink1Description: https://datasheet.octopart.com:443/BM06B-SRSS-TB%28LF%29%28SN%29-JST-datasheet-120967.pdf?src-supplier=Upverter; ComponentLink2URL: https://datasheet.octopart.com:443/BM06B-SRSS-TB%28LF%29%28SN%29-JST-datasheet-152738602.pdf?src-supplier=Upverter; ComponentLink2Description: https://datasheet.octopart.com:443/BM06B-SRSS-TB%28LF%29%28SN%29-JST-datasheet-152738602.pdf?src-supplier=Upverter; ComponentLink3URL: https://datasheet.octopart.com:443/BM06B-SRSS-TB%28LF%29%28SN%29-JST-datasheet-12489618.pdf?src-supplier=Component+Distributors+Inc.; ComponentLink3Description: https://datasheet.octopart.com:443/BM06B-SRSS-TB%28LF%29%28SN%29-JST-datasheet-12489618.pdf?src-supplier=Component+Distributors+Inc.; ComponentLink4URL: https://datasheet.octopart.com:443/BM06B-SRSS-TB%28LF%29%28SN%29-JST-datasheet-65849987.pdf?src-supplier=element14+APAC; ComponentLink4Description: https://datasheet.octopart.com:443/BM06B-SRSS-TB%28LF%29%28SN%29-JST-datasheet-65849987.pdf?src-supplier=element14+APAC; ComponentLink5URL: https://datasheet.octopart.com:443/BM06B-SRSS-TB%28LF%29%28SN%29-JST-datasheet-12513377.pdf?src-supplier=Factory+Futures; ComponentLink5Description: https://datasheet.octopart.com:443/BM06B-SRSS-TB%28LF%29%28SN%29-JST-datasheet-12513377.pdf?src-supplier=Factory+Futures; ComponentLink6URL: https://datasheet.octopart.com:443/BM06B-SRSS-TB%28LF%29%28SN%29-JST-datasheet-5322443.pdf?src-supplier=Newark; ComponentLink6Description: https://datasheet.octopart.com:443/BM06B-SRSS-TB%28LF%29%28SN%29-JST-datasheet-5322443.pdf?src-supplier=Newark; ComponentLink7URL: https://datasheet.octopart.com:443/BM06B-SRSS-TB-%28LF%29%28SN%29-JST-datasheet-44103209.pdf?src-supplier=TME; ComponentLink7Description: https://datasheet.octopart.com:443/BM06B-SRSS-TB-%28LF%29%28SN%29-JST-datasheet-44103209.pdf?src-supplier=TME; ComponentLink8URL: https://datasheet.octopart.com:443/BM06B-SRSS-TB%28LF%29%28SN%29-JST-datasheet-8330955.pdf?src-supplier=Farnell; ComponentLink8Description: https://datasheet.octopart.com:443/BM06B-SRSS-TB%28LF%29%28SN%29-JST-datasheet-8330955.pdf?src-supplier=Farnell
J4 = 6POS: Connector Header, SR Series, 6 Position, 1.00mm, 50V, Surface Mount, Tin, Natural
Q1 Q2 Q5 Q6 = NPN_PHOTOTRANSISTOR: TEFT4300 Series 925 nm ±60° 70 V 50 mA Silicon NPN Phototransistor - T-5; Manufacturer: Vishay; Collector Emitter Breakdown Voltage: 70V; Collector Emitter Saturation Voltage: 300mV; Dark Current: 200nA; Fall Time: 2.3µs; Lens Style: Domed; Max Collector Current: 50mA; Max Power Dissipation: 185mW; Number of Channels: 1; Peak Wavelength: 925nm; Power Consumption: 100mW; Shape: Round; Viewing Angle: 30°; Supplier: Avnet; Supplier Part Number: TEFT4300; Manufacturer Part Number: TEFT4300; RoHS: Compliant; Category: Photoelectric Sensors; Stock: 5000; Pricing: 5000=0.17962, 10000=0.17625, 20000=0.17407, 40000=0.17091, 80000=0.16588 (USD); Case/Package: T; Collector Emitter Voltage (VCEO): 70V; Height: 4.5mm; Harmonized Tariff Schedule (HTS) Code: 8541.40.70.80; Introduction Date: 1995-08-01; Lead Free: Lead Free; Length: 3.2mm; Lifecycle Status: Production; Max Operating Temperature: 100°C; Min Operating Temperature: -40°C; Mounting Technology: Through Hole; Number of Circuits: 1; Number of Elements: 1; Pins: 2; Orientation: Top View; Polarity: NPN; Power Dissipation: 100mW; Radiation Hardening: No; REACH SVHC: Yes; Schedule B: 8541407080, 8541407080|8541407080|8541407080|8541407080|8541407080; Wavelength: 925nm; Width: 3.9mm; ComponentLink1URL: https://datasheet.octopart.com:443/TEFT4300-Vishay-datasheet-181475792.pdf?src-supplier=IHS; ComponentLink1Description: https://datasheet.octopart.com:443/TEFT4300-Vishay-datasheet-181475792.pdf?src-supplier=IHS; ComponentLink2URL: https://datasheet.octopart.com:443/TEFT4300-Vishay-datasheet-181483772.pdf?src-supplier=IHS; ComponentLink2Description: https://datasheet.octopart.com:443/TEFT4300-Vishay-datasheet-181483772.pdf?src-supplier=IHS; ComponentLink3URL: https://datasheet.octopart.com:443/TEFT4300-Vishay-datasheet-12551779.pdf?src-supplier=Farnell; ComponentLink3Description: https://datasheet.octopart.com:443/TEFT4300-Vishay-datasheet-12551779.pdf?src-supplier=Farnell; ComponentLink4URL: https://datasheet.octopart.com:443/TEFT4300-Vishay-datasheet-8540529.pdf?src-supplier=Farnell; ComponentLink4Description: https://datasheet.octopart.com:443/TEFT4300-Vishay-datasheet-8540529.pdf?src-supplier=Farnell; ComponentLink5URL: https://datasheet.octopart.com:443/TEFT4300-Vishay-datasheet-62319322.pdf?src-supplier=element14+APAC; ComponentLink5Description: https://datasheet.octopart.com:443/TEFT4300-Vishay-datasheet-62319322.pdf?src-supplier=element14+APAC; ComponentLink6URL: https://datasheet.octopart.com:443/TEFT4300-Vishay-Semiconductor-datasheet-41195801.pdf?src-supplier=element14+APAC; ComponentLink6Description: https://datasheet.octopart.com:443/TEFT4300-Vishay-Semiconductor-datasheet-41195801.pdf?src-supplier=element14+APAC; ComponentLink7URL: https://datasheet.octopart.com:443/TEFT4300..-Vishay-datasheet-78863672.pdf?src-supplier=element14+APAC; ComponentLink7Description: https://datasheet.octopart.com:443/TEFT4300..-Vishay-datasheet-78863672.pdf?src-supplier=element14+APAC; ComponentLink8URL: https://datasheet.octopart.com:443/TEFT4300-Vishay-datasheet-68328189.pdf?src-supplier=TME; ComponentLink8Description: https://datasheet.octopart.com:443/TEFT4300-Vishay-datasheet-68328189.pdf?src-supplier=TME; ComponentLink9URL: https://datasheet.octopart.com:443/TEFT4300-Vishay-datasheet-33014373.pdf?src-supplier=Newark; ComponentLink9Description: https://datasheet.octopart.com:443/TEFT4300-Vishay-datasheet-33014373.pdf?src-supplier=Newark; ComponentLink10URL: https://datasheet.octopart.com:443/TEFT4300-Vishay-datasheet-63338.pdf?src-supplier=Newark; ComponentLink10Description: https://datasheet.octopart.com:443/TEFT4300-Vishay-datasheet-63338.pdf?src-supplier=Newark; ComponentLink11URL: http://sigma.octopart.com:80/rohs_statement/Vishay-company-15.pdf?src-supplier=Compliance+Statements; ComponentLink11Description: http://sigma.octopart.com:80/rohs_statement/Vishay-company-15.pdf?src-supplier=Compliance+Statements; Supplier 1: Avnet; Supplier Part Number 1: TEFT4300
Q3 Q4 Q7 Q8 = NMOS: Transistor MOSFET N-CH 60V 0.32A Automotive 3-Pin SC-70 T/R; Manufacturer: Nexperia; Manufacturer Lifecycle Status: RELEASED FOR SUPPLY; Continuous Drain Current (ID): 320mA; Drain to Source Resistance: 1.6Ω; Max Power Dissipation: 310mW; Number of Elements: 1; Supplier: Newark; Supplier Part Number: 58T1369; Manufacturer Part Number: BSS138PW,115; RoHS: Compliant; Category: MOSFETs; Stock: 868; Pricing: 5=0.35, 10=0.217, 25=0.189, 50=0.161, 100=0.133 (USD); China RoHS: Compliant; Contact Plating: Tin; Country of Origin: Malaysia; Export Control Classification Number (ECCN) Code: EAR99; Introduction Date: 2010-11-11; Lifecycle Status: Production; Max Operating Temperature: 150°C; Min Breakdown Voltage: 60V; Pins: 3; Number of Terminals: 3; Packaging: Tape & Reel; REACH SVHC: Yes; Schedule B: 8541210080, 8541210080|8541210080, 8541210080|8541210080|8541210080, 8541210080|8541210080|8541210080|8541210080; ComponentLink1URL: https://datasheet.octopart.com:443/BSS138PW%2C115-Nexperia-datasheet-87581096.pdf?src-supplier=Newark; ComponentLink1Description: https://datasheet.octopart.com:443/BSS138PW%2C115-Nexperia-datasheet-87581096.pdf?src-supplier=Newark; ComponentLink2URL: https://datasheet.octopart.com:443/BSS138PW%2C115-Nexperia-datasheet-10542180.pdf?src-supplier=IHS; ComponentLink2Description: https://datasheet.octopart.com:443/BSS138PW%2C115-Nexperia-datasheet-10542180.pdf?src-supplier=IHS; ComponentLink3URL: https://datasheet.octopart.com:443/BSS138PW%2C115-Nexperia-datasheet-180923270.pdf?src-supplier=Farnell; ComponentLink3Description: https://datasheet.octopart.com:443/BSS138PW%2C115-Nexperia-datasheet-180923270.pdf?src-supplier=Farnell; ComponentLink4URL: http://sigma.octopart.com:80/reach_statement/NXP-Semiconductors-company-13.pdf?src-supplier=Compliance+Statements; ComponentLink4Description: http://sigma.octopart.com:80/reach_statement/NXP-Semiconductors-company-13.pdf?src-supplier=Compliance+Statements; ComponentLink5URL: http://sigma.octopart.com:80/rohs_statement/NXP-Semiconductors-company-12.pdf?src-supplier=Compliance+Statements; ComponentLink5Description: http://sigma.octopart.com:80/rohs_statement/NXP-Semiconductors-company-12.pdf?src-supplier=Compliance+Statements; Supplier 1: Newark; Supplier Part Number 1: BSS138PW,115; Ratings: AEC-Q101
R1 R2 R14 R15 = RES: 100mW Thick Film Resistors 75V ±5% ±200ppm/℃ 3Ω 0603 Chip Resistor - Surface Mount ROHS; Manufacturer: Yageo Group; Manufacturer Part Number: RC0603JR-073RL; Temperature Coefficient: 200ppm/°C; Voltage Rating: 50V; Value: 3R; Supplier 1: Newark; Supplier Part Number 1: RC0603JR-073RL; RoHS: Compliant; Category: Chip SMD Resistors; Stock: 51377; Pricing: 1=0.101, 25=0.011, 50=0.011, 100=0.010 (USD); Case/Package: 0603; Case Code (Imperial): 0603; China RoHS: Non-Compliant; Composition: Thick Film; Contact Plating: Lead, Tin; Country of Origin: Mainland China, Taiwan; Depth: 800µm; Export Control Classification Number (ECCN) Code: EAR99; Features: Moisture Resistant; Height: 450µm; Harmonized Tariff Schedule (HTS) Code: 8533.21.00.30; Introduction Date: 2008-07-18; Lead Free: Lead Free; Length: 1.6mm; Lifecycle Status: Production; Max Operating Temperature: 155°C; Max Power Dissipation: 100mW; Military Standard: Not; Min Operating Temperature: -55°C; Mounting Technology: Surface Mount; Number of Terminals: 2; Number of Terminations: 2; Power Rating: 100mW; Radiation Hardening: No; REACH SVHC: Yes; Schedule B: 8533210045, 8533210045|8533210045|8533210045|8533210045|8533210045; Termination: SMD/SMT; Tolerance: 5%; Voltage Rating (DC): 50V; Width: 800µm; Working Voltage: 75V; ComponentLink1URL: https://datasheet.octopart.com:443/RC0603JR-073RL-Yageo-datasheet-175887523.pdf?src-supplier=IHS; ComponentLink1Description: https://datasheet.octopart.com:443/RC0603JR-073RL-Yageo-datasheet-175887523.pdf?src-supplier=IHS; ComponentLink2URL: https://datasheet.octopart.com:443/RC0603JR-073RL-Yageo-Group-datasheet-176638170.pdf?src-supplier=Future+Electronics; ComponentLink2Description: https://datasheet.octopart.com:443/RC0603JR-073RL-Yageo-Group-datasheet-176638170.pdf?src-supplier=Future+Electronics; ComponentLink3URL: https://datasheet.octopart.com:443/RC0603JR-073RL-Yageo-datasheet-164759695.pdf?src-supplier=Future+Electronics; ComponentLink3Description: https://datasheet.octopart.com:443/RC0603JR-073RL-Yageo-datasheet-164759695.pdf?src-supplier=Future+Electronics; ComponentLink4URL: https://datasheet.octopart.com:443/RC0603JR-073RL-Yageo-datasheet-137700087.pdf?src-supplier=Future+Electronics; ComponentLink4Description: https://datasheet.octopart.com:443/RC0603JR-073RL-Yageo-datasheet-137700087.pdf?src-supplier=Future+Electronics; ComponentLink5URL: https://datasheet.octopart.com:443/RC0603JR-073RL-Yageo-datasheet-15599030.pdf?src-supplier=Future+Electronics; ComponentLink5Description: https://datasheet.octopart.com:443/RC0603JR-073RL-Yageo-datasheet-15599030.pdf?src-supplier=Future+Electronics; ComponentLink6URL: https://datasheet.octopart.com:443/RC0603JR-073RL-Yageo-datasheet-12596169.pdf?src-supplier=Future+Electronics; ComponentLink6Description: https://datasheet.octopart.com:443/RC0603JR-073RL-Yageo-datasheet-12596169.pdf?src-supplier=Future+Electronics; ComponentLink7URL: https://datasheet.octopart.com:443/RC0603JR-073RL-Yageo-datasheet-8328172.pdf?src-supplier=TME; ComponentLink7Description: https://datasheet.octopart.com:443/RC0603JR-073RL-Yageo-datasheet-8328172.pdf?src-supplier=TME; ComponentLink8URL: https://datasheet.octopart.com/RC0603JR-073RL-Yageo-datasheet-73766026.pdf; ComponentLink8Description: https://datasheet.octopart.com/RC0603JR-073RL-Yageo-datasheet-73766026.pdf; ComponentLink9URL: https://datasheet.octopart.com:443/RC0603JR-073RL-Yageo-datasheet-118562.pdf?src-supplier=DigiKey; ComponentLink9Description: https://datasheet.octopart.com:443/RC0603JR-073RL-Yageo-datasheet-118562.pdf?src-supplier=DigiKey; ComponentLink10URL: http://sigma.octopart.com:80/conflict_mineral_statement/Yageo-company-3.pdf?src-supplier=Compliance+Statements; ComponentLink10Description: http://sigma.octopart.com:80/conflict_mineral_statement/Yageo-company-3.pdf?src-supplier=Compliance+Statements; ComponentLink11URL: http://sigma.octopart.com:80/rohs_statement/Yageo-company-2.pdf?src-supplier=Compliance+Statements; ComponentLink11Description: http://sigma.octopart.com:80/rohs_statement/Yageo-company-2.pdf?src-supplier=Compliance+Statements